# EAGLE design nxt (EAGLE 5.11)
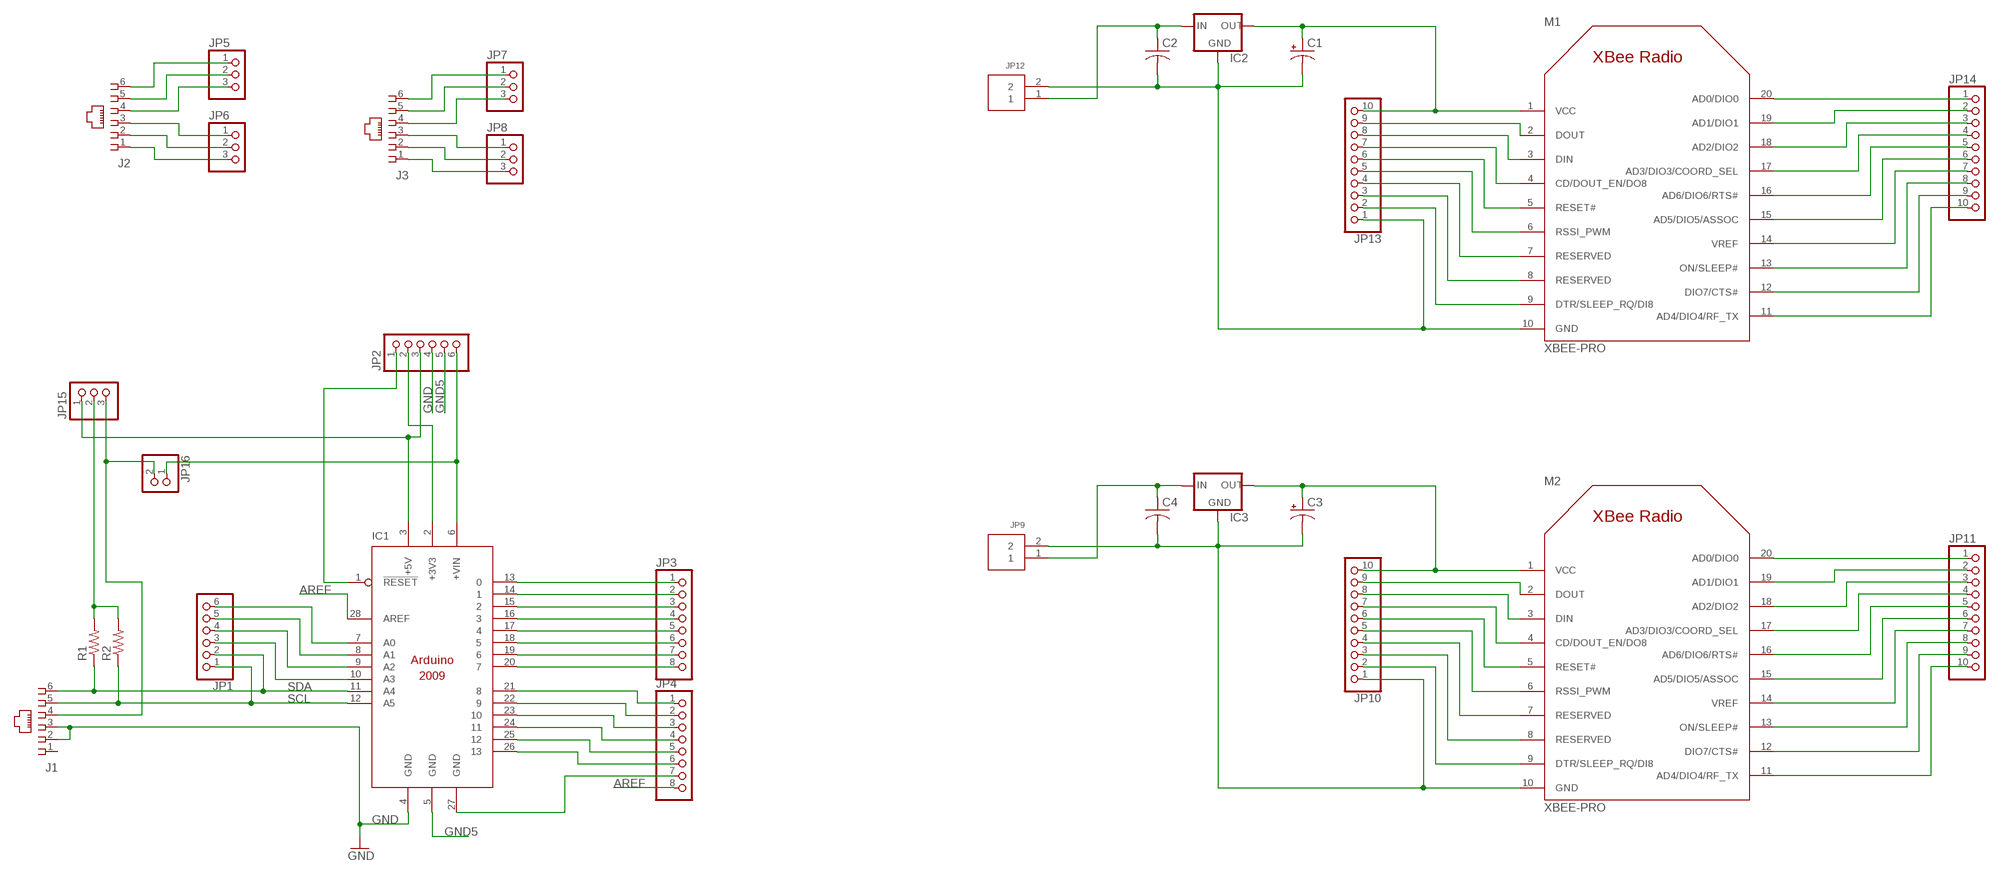
[diagram p0: schematic, sheet 1]

## Parts
C1  CPOL-USE2.5-7  [E2,5-7]
C2  C-US025-040X050  [C025-040X050]
C3  CPOL-USE2.5-7  [E2,5-7]
C4  C-US025-040X050  [C025-040X050]
IC1  ARDUINO2009_11  [ARDUINO2009_1]
IC2  78XXL  [78XXL]
IC3  78XXL  [78XXL]
J1  NXTCONN  [NXTCONN]
J2  NXTCONN  [NXTCONN]
J3  NXTCONN  [NXTCONN]
JP1  PINHD-1X6  [1X06]
JP2  PINHD-1X6  [1X06]
JP3  PINHD-1X8  [1X08]
JP4  PINHD-1X8  [1X08]
JP5  PINHD-1X3  [1X03]
JP6  PINHD-1X3  [1X03]
JP7  PINHD-1X3  [1X03]
JP8  PINHD-1X3  [1X03]
JP9  2PIN  [B2B-PH-K-S]
JP10  PINHD-1X10  [1X10]
JP11  PINHD-1X10  [1X10]
JP12  2PIN  [B2B-PH-K-S]
JP13  PINHD-1X10  [1X10]
JP14  PINHD-1X10  [1X10]
JP15  PINHD-1X3  [1X03]
JP16  PINHD-1X2  [1X02]
M1  XBEE-PRO  [XBEE-PRO]
M2  XBEE-PRO  [XBEE-PRO]
R1  R-US_0207/10  [0207/10]
R2  R-US_0207/10  [0207/10]

## Nets
AREF: IC1.28(AREF) JP4.8
GND: IC1.4(GND) J1.2 J1.3 JP2.4
GND5: IC1.5(GND) JP2.5
N$1: J1.4 JP15.3 JP16.2
N$2: J3.4 JP7.3
N$3: IC1.6(+VIN) JP2.6 JP16.1
N$4: IC1.13 JP3.1
N$5: IC1.14 JP3.2
N$6: IC1.15 JP3.3
N$7: IC1.16 JP3.4
N$8: IC1.17 JP3.5
N$9: IC1.18 JP3.6
N$10: IC1.19 JP3.7
N$11: IC1.20 JP3.8
N$12: IC1.21 JP4.1
N$13: IC1.22 JP4.2
N$14: IC1.23 JP4.3
N$15: IC1.24 JP4.4
N$16: IC1.25 JP4.5
N$17: IC1.26 JP4.6
N$18: IC1.27(GND) JP4.7
N$19: C1.+ IC2.OUT JP13.10 M1.1(VCC)
N$20: JP15.2 R1.2 R2.2
N$21: IC1.2(+3V3) JP2.2
N$22: IC1.10(A3) JP1.3
N$23: IC1.9(A2) JP1.4
N$24: IC1.8(A1) JP1.5
N$25: IC1.7(A0) JP1.6
N$26: IC1.1(!RESET) JP2.1
N$27: IC1.3(+5V) JP2.3 JP15.1
N$28: JP13.9 M1.2(DOUT)
N$29: JP13.8 M1.3(DIN)
N$30: JP13.7 M1.4(CD/DOUT_EN/DO8)
N$31: JP13.6 M1.5(RESET#)
N$32: JP13.5 M1.6(RSSI_PWM)
N$33: JP13.4 M1.7(RESERVED)
N$34: JP13.3 M1.8(RESERVED)
N$35: JP13.2 M1.9(DTR/SLEEP_RQ/DI8)
N$36: JP14.1 M1.20(AD0/DIO0)
N$37: JP14.10 M1.11(AD4/DIO4/RF_TX)
N$38: JP14.9 M1.12(DIO7/CTS#)
N$39: JP14.8 M1.13(ON/SLEEP#)
N$40: JP14.7 M1.14(VREF)
N$41: JP14.6 M1.15(AD5/DIO5/ASSOC)
N$42: JP14.5 M1.16(AD6/DIO6/RTS#)
N$43: JP14.4 M1.17(AD3/DIO3/COORD_SEL)
N$44: JP14.3 M1.18(AD2/DIO2)
N$45: JP14.2 M1.19(AD1/DIO1)
N$46: C2.1 IC2.IN JP12.1
N$47: C1.- C2.2 IC2.GND JP12.2 JP13.1 M1.10(GND)
N$48: J2.4 JP5.3
N$49: J2.5 JP5.2
N$50: J2.6 JP5.1
N$51: J2.3 JP6.1
N$52: J2.2 JP6.2
N$53: J2.1 JP6.3
N$54: J3.5 JP7.2
N$55: J3.6 JP7.1
N$56: J3.3 JP8.1
N$57: J3.2 JP8.2
N$58: J3.1 JP8.3
N$59: C3.+ IC3.OUT JP10.10 M2.1(VCC)
N$60: JP10.9 M2.2(DOUT)
N$61: JP10.8 M2.3(DIN)
N$62: JP10.7 M2.4(CD/DOUT_EN/DO8)
N$63: JP10.6 M2.5(RESET#)
N$64: JP10.5 M2.6(RSSI_PWM)
N$65: JP10.4 M2.7(RESERVED)
N$66: JP10.3 M2.8(RESERVED)
N$67: JP10.2 M2.9(DTR/SLEEP_RQ/DI8)
N$68: JP11.1 M2.20(AD0/DIO0)
N$69: JP11.10 M2.11(AD4/DIO4/RF_TX)
N$70: JP11.9 M2.12(DIO7/CTS#)
N$71: JP11.8 M2.13(ON/SLEEP#)
N$72: JP11.7 M2.14(VREF)
N$73: JP11.6 M2.15(AD5/DIO5/ASSOC)
N$74: JP11.5 M2.16(AD6/DIO6/RTS#)
N$75: JP11.4 M2.17(AD3/DIO3/COORD_SEL)
N$76: JP11.3 M2.18(AD2/DIO2)
N$77: JP11.2 M2.19(AD1/DIO1)
N$78: C4.1 IC3.IN JP9.1
N$79: C3.- C4.2 IC3.GND JP9.2 JP10.1 M2.10(GND)
SCL: IC1.12(A5) J1.5 JP1.1 R2.1
SDA: IC1.11(A4) J1.6 JP1.2 R1.1
Unconnected: J1.1

## Library data of the parts
C1 C3 = rcl:CPOL-US: POLARIZED CAPACITOR, American symbol
C2 C4 = rcl:C-US: CAPACITOR, American symbol
IC1 = arduino:ARDUINO2009_1: The Arduino Duemilanove ("2009") is a microcontroller board based on the ATmega168 or ATmega328. - 14 digital input/output pins (of which 6 can be used as PWM outputs) - 6 analog inputs, a 16 MHz crystal oscillator - USB connection - power jack - ISP header - reset button It contains everything needed to support the microcontroller; simply connect it to a computer with a USB cable or power it with a AC-to-DC adapter or battery to get started http://arduino.cc/en/Main/ArduinoBoardDuemilanove
IC2 IC3 = v-reg:78XXL: VOLTAGE REGULATOR
J1-J3 = eagle-file-for-female-connector:NXTCONN: AMP connector
JP1 JP2 = pinhead:PINHD-1X6: PIN HEADER
JP3 JP4 = pinhead:PINHD-1X8: PIN HEADER
JP5-JP8 JP15 = pinhead:PINHD-1X3: PIN HEADER
JP9 JP12 = jst_eph:2PIN
JP10 JP11 JP13 JP14 = pinhead:PINHD-1X10: PIN HEADER
JP16 = pinhead:PINHD-1X2: PIN HEADER
M1 M2 = xbee_r1:XBEE
R1 R2 = rcl:R-US_: RESISTOR, American symbol

## Net classes
0 default: width 0.813 mm

## Board
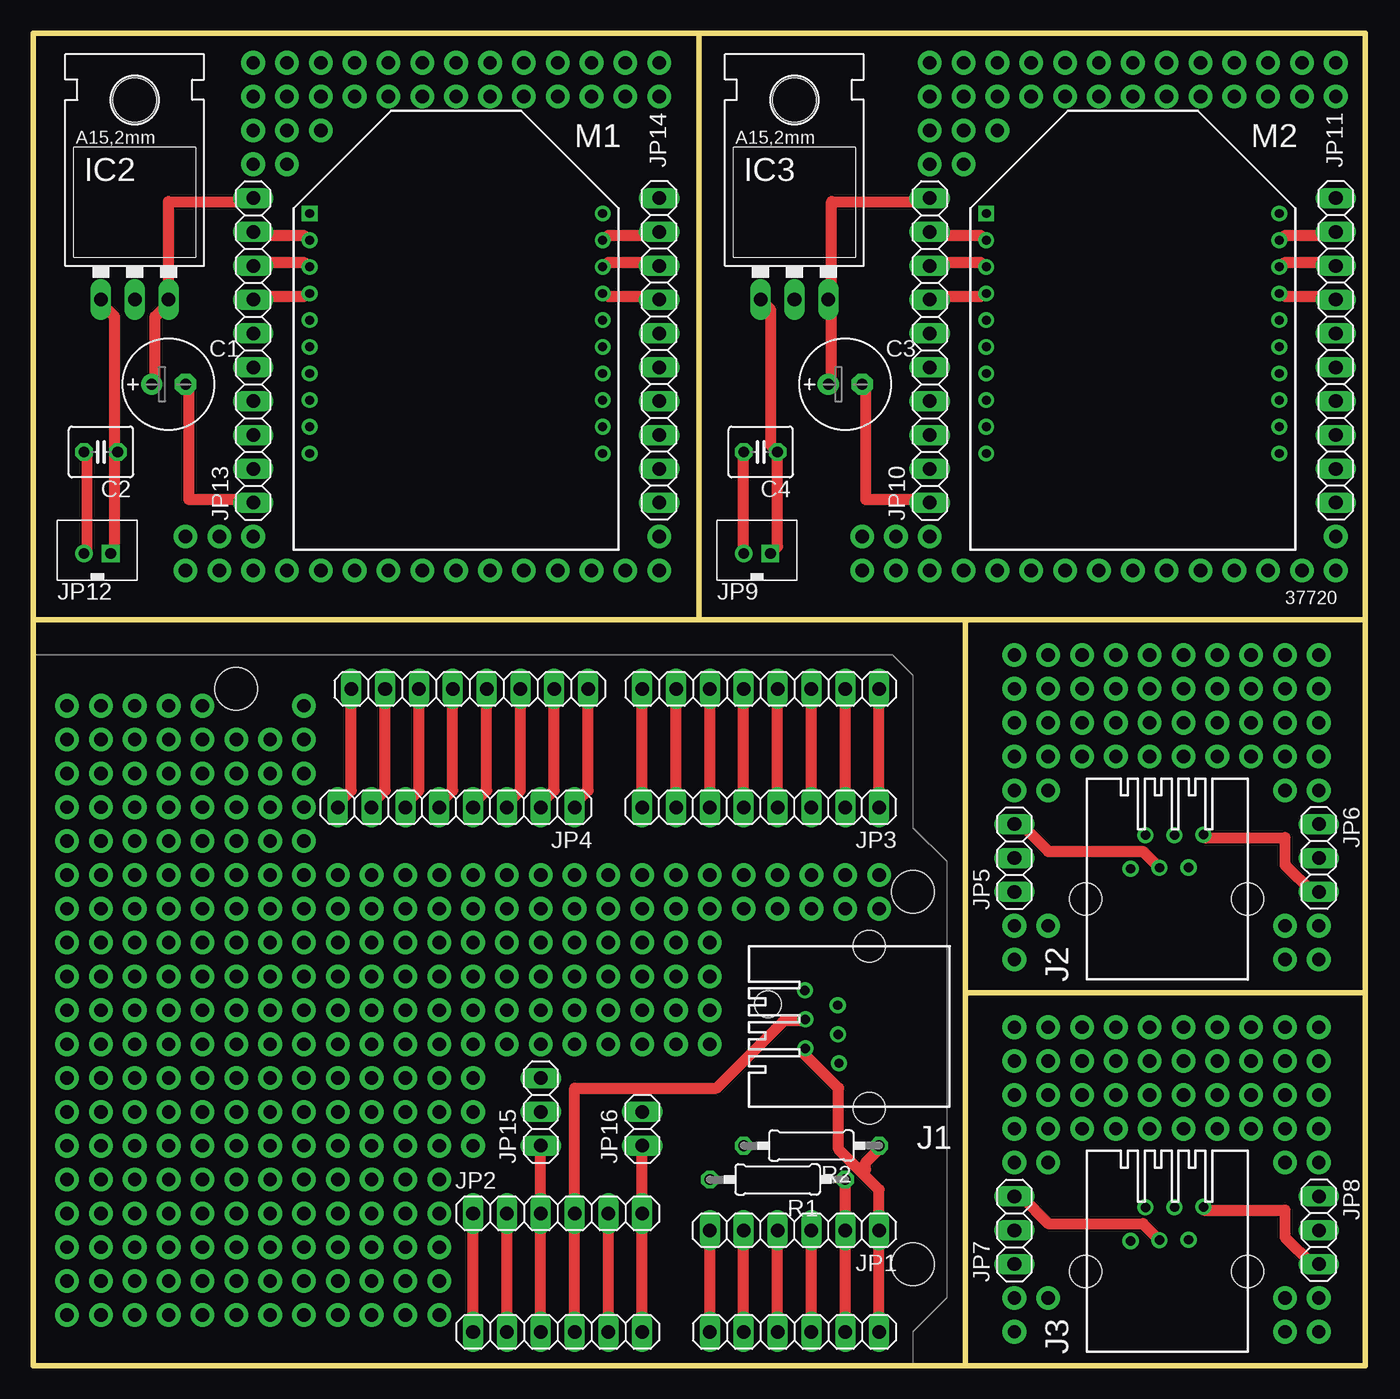
[diagram p1: board, top side]
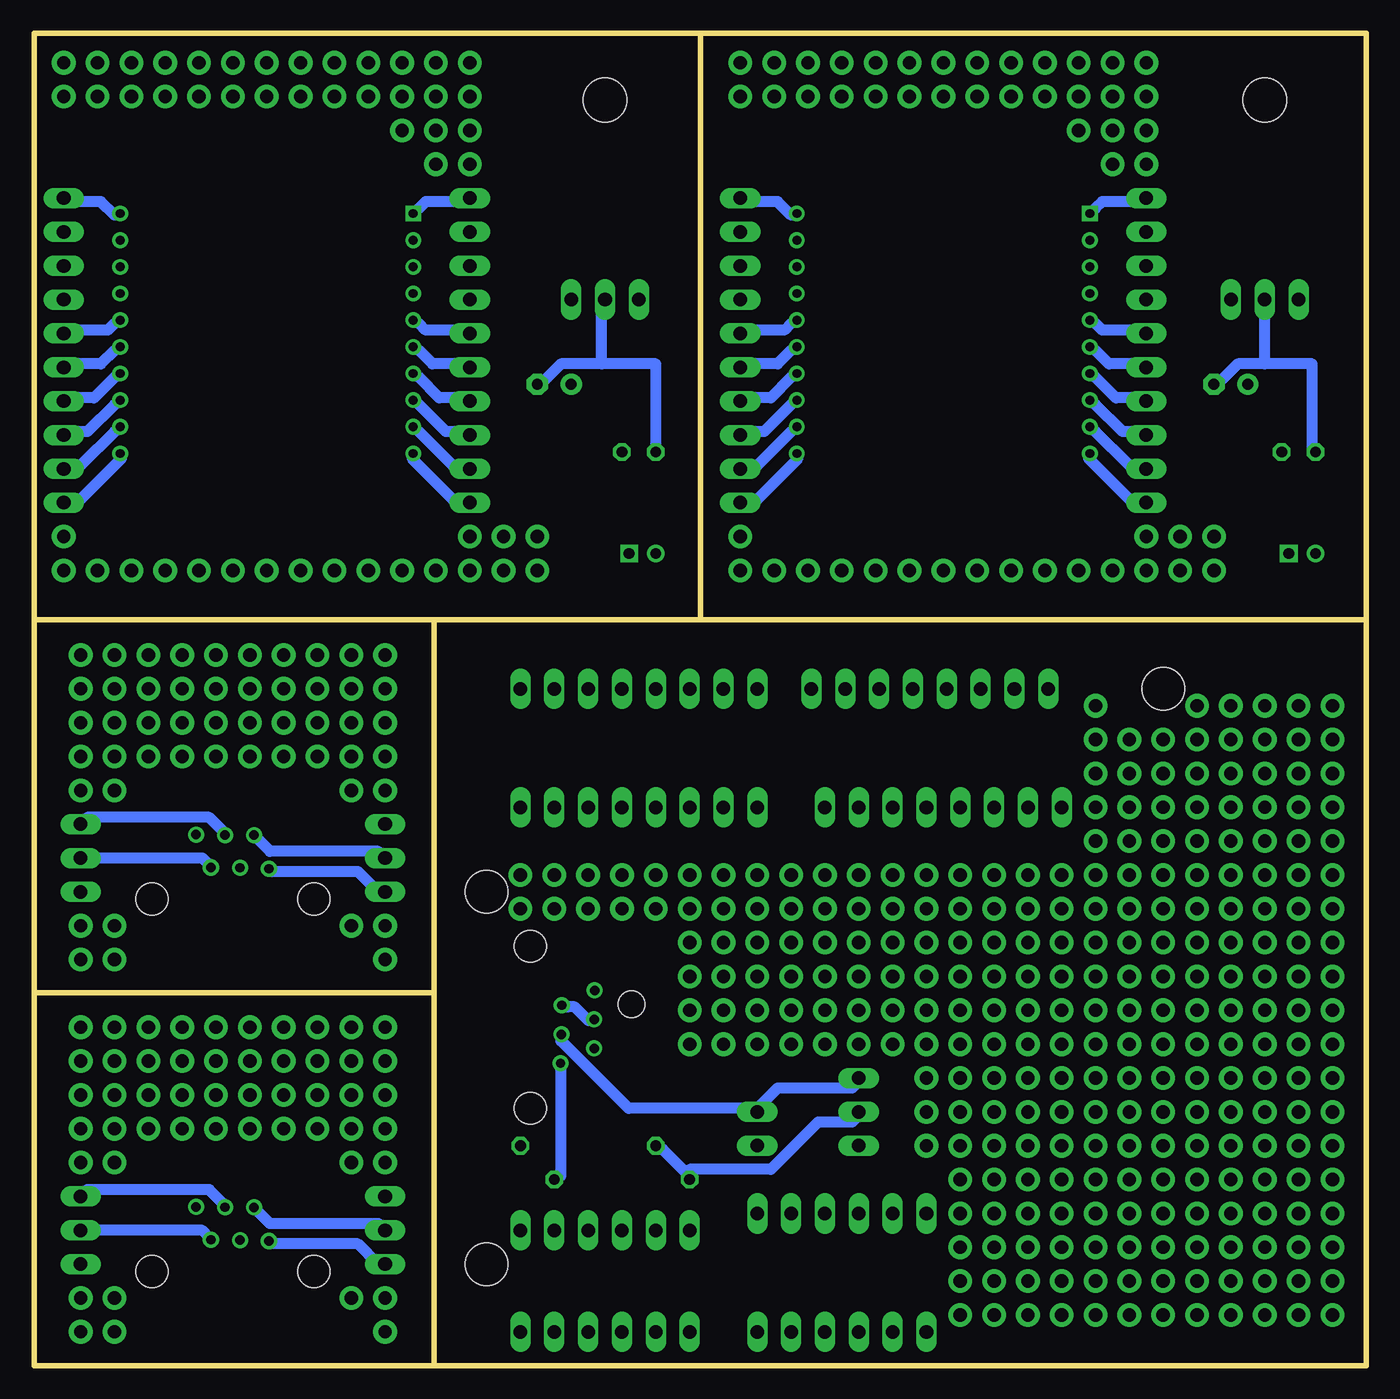
[diagram p2: board, bottom side, seen from below]

Size 100 x 100 mm. Coordinates in mm from the lower left corner, seen from the top.
Outline: 0,56 0,0 70,0
Outline: 0,56 0,100 50,100
Outline: 50,100 100,100 100,56
Outline: 100,56 100,28
Outline: 100,28 100,0 70,0
Outline: 0,56 50,56
Outline: 50,56 70,56
Outline: 70,56 100,56
Outline: 70,56 70,28
Outline: 70,28 70,0
Outline: 70,28 100,28
Outline: 50,56 50,100
Copper layers (1*16): Top 0.035mm / dielectric 1.5mm / Bottom 0.035mm
Design rules "Fusion_eagle_rule_v1.1": minimum track width 6mil, minimum drill 12mil, track to track 6mil, track to pad 6mil, pad to pad 6mil, via to via 6mil, smd to smd 0mil, copper to edge 10mil, drill to drill 10mil, minimum pad ring 10mil, minimum via ring 6mil, stop-mask expansion 2mil, vias tented up to drill 100mil, thermal gap 10mil

### Footprints (pad centres in the part's own frame; a part is rotated, then mirrored left to right if it is on the bottom)
E2,5-7 = drill 0.813 pad 1.6 round: + -1.27,0 | drill 0.813 pad 1.6 octagon: - 1.27,0
C025-040X050 = drill 0.813 octagon: 1 -1.27,0; 2 1.27,0
ARDUINO2009_1 = drill 1.016 long: 1 33.02,2.54; 2 35.56,2.54; 3 38.1,2.54; 4 40.64,2.54; 5 43.18,2.54; 6 45.72,2.54; 7 50.8,2.54; 8 53.34,2.54; 9 55.88,2.54; 10 58.42,2.54; 11 60.96,2.54; 12 63.5,2.54; 13 63.5,50.8; 14 60.96,50.8; 15 58.42,50.8; 16 55.88,50.8; 17 53.34,50.8; 18 50.8,50.8; 19 48.26,50.8; 20 45.72,50.8; 21 41.656,50.8; 22 39.116,50.8; 23 36.576,50.8; 24 34.036,50.8; 25 31.496,50.8; 26 28.956,50.8; 27 26.416,50.8; 28 23.876,50.8 | hole 3.2: 15.24,50.8; 66.04,35.56; 66.04,7.62 | hole 2: 55.17,27.114
78XXL = drill 1.016 long: GND 0,-3.81; IN -2.54,-3.81; OUT 2.54,-3.81 | hole 3.302: 0,11.176
NXTCONN = drill 0.7 round: 1 2.764,6.84; 2 1.647,4.372; 3 0.59,6.805; 4 -0.539,4.346; 5 -1.584,6.804; 6 -2.705,4.28 | hole 2.4: -6.08,2; 6.08,2
1X06 = drill 1.016 long: 1 -6.35,0; 2 -3.81,0; 3 -1.27,0; 4 1.27,0; 5 3.81,0; 6 6.35,0
1X08 = drill 1.016 long: 1 -8.89,0; 2 -6.35,0; 3 -3.81,0; 4 -1.27,0; 5 1.27,0; 6 3.81,0; 7 6.35,0; 8 8.89,0
1X03 = drill 1.016 long: 1 -2.54,0; 2 0,0; 3 2.54,0
B2B-PH-K-S = drill 0.813 square: 1 2,0 | drill 0.813 round: 2 0,0
1X10 = drill 1.016 long: 1 -11.43,0; 2 -8.89,0; 3 -6.35,0; 4 -3.81,0; 5 -1.27,0; 6 1.27,0; 7 3.81,0; 8 6.35,0; 9 8.89,0; 10 11.43,0
1X02 = drill 1.016 long: 1 -1.27,0; 2 1.27,0
XBEE-PRO = drill 0.66 square: 1 -11,9 | drill 0.66 round: 2 -11,7; 3 -11,5; 4 -11,3; 5 -11,1; 6 -11,-1; 7 -11,-3; 8 -11,-5; 9 -11,-7; 10 -11,-9; 11 11,-9; 12 11,-7; 13 11,-5; 14 11,-3; 15 11,-1; 16 11,1; 17 11,3; 18 11,5; 19 11,7; 20 11,9
0207/10 = drill 0.813 octagon: 1 -5.08,0; 2 5.08,0

### Placement (x,y rotation side)
C1  10.16,73.66 0 top
C2  5.08,68.58 180 top
C3  60.96,73.66 0 top
C4  54.61,68.58 180 top
IC1  0,0 0 top
IC2  7.62,83.82 0 top
IC3  57.15,83.82 0 top
J1  64.77,25.4 90 top
J2  85.09,33.02 0 top
J3  85.09,5.08 0 top
JP1  57.15,10.16 180 top
JP2  39.37,11.43 0 top
JP3  54.61,41.91 180 top
JP4  31.75,41.91 180 top
JP5  73.66,38.1 90 top
JP6  96.52,38.1 270 top
JP7  73.66,10.16 90 top
JP8  96.52,10.16 270 top
JP9  53.34,60.96 0 top
JP10  67.31,76.2 90 top
JP11  97.79,76.2 270 top
JP12  3.81,60.96 0 top
JP13  16.51,76.2 90 top
JP14  46.99,76.2 270 top
JP15  38.1,19.05 90 top
JP16  45.72,17.78 90 top
M1  31.75,77.47 0 top
M2  82.55,77.47 0 top
R1  55.88,13.97 180 top
R2  58.42,16.51 180 top

### Tracks (layer width: path | path; a pad name or v marks a point on that pad's centre or on a via)
AREF
  Top 0.813: IC1.28 23.88,43.18 22.86,42.16 JP4.8
GND
  Top 0.813: IC1.4 JP2.4 40.64,20.83 51.31,20.83 56.39,25.91 57.91,25.91 J1.3
  Bottom 0.813: J1.3 58.42,25.91 59.44,26.92 59.94,26.92 J1.2
GND5
  Top 0.813: IC1.5 JP2.5
N$1
  Bottom 0.813: 45.72,19.3 55.37,19.3 60.45,24.38 J1.4 | 45.72,19.3 44.2,20.83 38.61,20.83 38.1,21.34 JP15.3 | 45.72,19.3 JP16.2
N$2
  Top 0.813: JP7.3 74.17,12.7 76.2,10.67 83.31,10.67 84.33,9.65 J3.4
N$3
  Top 0.813: IC1.6 JP2.6 JP16.1
N$4
  Top 0.813: JP3.1 IC1.13
N$5
  Top 0.813: JP3.2 IC1.14
N$6
  Top 0.813: JP3.3 IC1.15
N$7
  Top 0.813: JP3.4 IC1.16
N$8
  Top 0.813: JP3.5 IC1.17
N$9
  Top 0.813: JP3.6 IC1.18
N$10
  Top 0.813: JP3.7 IC1.19
N$11
  Top 0.813: JP3.8 IC1.20
N$12
  Top 0.813: IC1.21 41.66,43.18 40.64,42.16 JP4.1
N$13
  Top 0.813: IC1.22 39.12,43.18 38.1,42.16 JP4.2
N$14
  Top 0.813: IC1.23 36.58,43.18 35.56,42.16 JP4.3
N$15
  Top 0.813: IC1.24 34.04,43.18 33.02,42.16 JP4.4
N$16
  Top 0.813: IC1.25 31.5,43.18 30.48,42.16 JP4.5
N$17
  Top 0.813: IC1.26 28.96,43.18 27.94,42.16 JP4.6
N$18
  Top 0.813: IC1.27 26.42,43.18 25.4,42.16 JP4.7
N$19
  Top 0.813: C1.+ 9.14,73.66 9.14,78.74 10.16,79.76 IC2.OUT 10.16,87.38 16.26,87.38 JP13.10
  Bottom 0.813: M1.1 20.32,86.87 19.81,87.38 16.76,87.38 JP13.10
N$20
  Bottom 0.813: 51.05,14.48 52.83,16.26 53.34,16.26 R2.2 | 51.05,14.48 50.8,14.22 R1.2 | JP15.2 38.1,18.8 38.61,18.29 41.15,18.29 44.7,14.73 50.8,14.73 51.05,14.48
N$21
  Top 0.813: IC1.2 JP2.2
N$22
  Top 0.813: IC1.10 JP1.3
N$23
  Top 0.813: IC1.9 JP1.4
N$24
  Top 0.813: IC1.8 JP1.5
N$25
  Top 0.813: IC1.7 JP1.6
N$26
  Top 0.813: IC1.1 JP2.1
N$27
  Top 0.813: IC1.3 JP2.3 JP15.1
N$28
  Top 0.813: M1.2 20.32,84.84 16.76,84.84 JP13.9
N$29
  Top 0.813: M1.3 20.32,82.8 16.76,82.8 JP13.8
N$30
  Top 0.813: M1.4 20.32,80.26 16.76,80.26 JP13.7
N$31
  Bottom 0.813: M1.5 20.32,78.23 19.81,77.72 16.76,77.72 JP13.6
N$32
  Bottom 0.813: M1.6 20.32,76.2 19.3,75.18 16.76,75.18 JP13.5
N$33
  Bottom 0.813: M1.7 20.32,74.17 18.8,72.64 16.76,72.64 JP13.4
N$34
  Bottom 0.813: M1.8 20.32,72.14 18.29,70.1 16.76,70.1 JP13.3
N$35
  Bottom 0.813: M1.9 20.32,70.1 17.78,67.56 16.76,67.56 JP13.2
N$36
  Bottom 0.813: M1.20 43.18,86.36 44.2,87.38 46.74,87.38 JP14.1
N$37
  Bottom 0.813: M1.11 42.67,68.07 45.72,65.02 46.74,65.02 JP14.10
N$38
  Bottom 0.813: M1.12 43.18,70.1 45.72,67.56 46.74,67.56 JP14.9
N$39
  Bottom 0.813: M1.13 43.18,72.14 45.21,70.1 46.74,70.1 JP14.8
N$40
  Bottom 0.813: M1.14 43.18,74.17 44.7,72.64 46.74,72.64 JP14.7
N$41
  Bottom 0.813: M1.15 43.18,76.2 44.2,75.18 46.74,75.18 JP14.6
N$42
  Bottom 0.813: M1.16 43.18,78.23 43.69,77.72 46.74,77.72 JP14.5
N$43
  Top 0.813: M1.17 43.18,80.26 46.74,80.26 JP14.4
N$44
  Top 0.813: M1.18 43.18,82.8 46.74,82.8 JP14.3
N$45
  Top 0.813: M1.19 43.18,84.84 46.74,84.84 JP14.2
N$46
  Top 0.813: 6.1,68.58 6.1,60.96 JP12.1 | 6.1,68.58 6.1,78.74 5.08,79.76 IC2.IN | 6.1,68.58 C2.1
N$47
  Top 0.813: JP12.2 4.06,60.96 4.06,68.58 C2.2 | JP13.1 16.26,65.02 11.68,65.02 11.68,73.66 C1.-
  Bottom 0.813: M1.10 20.83,68.07 17.78,65.02 16.76,65.02 JP13.1 | 7.62,75.18 9.65,75.18 11.18,73.66 C1.- | 7.62,75.18 IC2.GND | 7.62,75.18 4.06,75.18 4.06,68.58 C2.2
N$48
  Top 0.813: JP5.3 74.17,40.64 76.2,38.61 83.31,38.61 84.33,37.59 J2.4
N$49
  Bottom 0.813: JP5.2 74.17,38.61 82.3,38.61 83.31,39.62 J2.5
N$50
  Bottom 0.813: JP5.1 74.17,35.56 75.69,37.08 82.3,37.08 J2.6
N$51
  Bottom 0.813: JP6.1 96.01,41.15 86.87,41.15 85.85,40.13 J2.3
N$52
  Bottom 0.813: JP6.2 87.38,38.1 86.87,37.59 J2.2
N$53
  Top 0.813: JP6.3 96.01,35.56 93.98,37.59 93.98,39.62 87.88,39.62 J2.1
N$54
  Bottom 0.813: JP7.2 74.17,10.67 82.3,10.67 83.31,11.68 J3.5
N$55
  Bottom 0.813: JP7.1 74.17,7.62 75.69,9.14 82.3,9.14 J3.6
N$56
  Bottom 0.813: JP8.1 96.01,13.21 86.87,13.21 85.85,12.19 J3.3
N$57
  Bottom 0.813: JP8.2 87.38,10.16 86.87,9.65 J3.2
N$58
  Top 0.813: JP8.3 96.01,7.62 93.98,9.65 93.98,11.68 87.88,11.68 J3.1
N$59
  Top 0.813: C3.+ 59.94,73.66 59.94,79.76 IC3.OUT 59.94,80.26 59.94,87.38 67.06,87.38 JP10.10
  Bottom 0.813: M2.1 71.12,86.87 70.61,87.38 67.56,87.38 JP10.10
N$60
  Top 0.813: M2.2 71.12,84.84 67.56,84.84 JP10.9
N$61
  Top 0.813: M2.3 71.12,82.8 67.56,82.8 JP10.8
N$62
  Top 0.813: M2.4 71.12,80.26 67.56,80.26 JP10.7
N$63
  Bottom 0.813: M2.5 71.12,78.23 70.61,77.72 67.56,77.72 JP10.6
N$64
  Bottom 0.813: M2.6 71.12,76.2 70.1,75.18 67.56,75.18 JP10.5
N$65
  Bottom 0.813: M2.7 71.12,74.17 69.6,72.64 67.56,72.64 JP10.4
N$66
  Bottom 0.813: M2.8 71.12,72.14 69.09,70.1 67.56,70.1 JP10.3
N$67
  Bottom 0.813: M2.9 71.12,70.1 68.58,67.56 67.56,67.56 JP10.2
N$68
  Bottom 0.813: M2.20 93.98,86.36 95,87.38 97.54,87.38 JP11.1
N$69
  Bottom 0.813: M2.11 93.47,68.07 96.52,65.02 97.54,65.02 JP11.10
N$70
  Bottom 0.813: M2.12 93.98,70.1 96.52,67.56 97.54,67.56 JP11.9
N$71
  Bottom 0.813: M2.13 93.98,72.14 96.01,70.1 97.54,70.1 JP11.8
N$72
  Bottom 0.813: M2.14 93.98,74.17 95.5,72.64 97.54,72.64 JP11.7
N$73
  Bottom 0.813: M2.15 93.98,76.2 95,75.18 97.54,75.18 JP11.6
N$74
  Bottom 0.813: M2.16 93.98,78.23 94.49,77.72 97.54,77.72 JP11.5
N$75
  Top 0.813: M2.17 93.98,80.26 97.54,80.26 JP11.4
N$76
  Top 0.813: M2.18 93.98,82.8 97.54,82.8 JP11.3
N$77
  Top 0.813: M2.19 93.98,84.84 97.54,84.84 JP11.2
N$78
  Top 0.813: JP9.1 55.37,60.96 55.88,61.47 C4.1 55.37,69.09 55.37,79.25 IC3.IN
N$79
  Top 0.813: JP9.2 C4.2 | JP10.1 67.06,65.02 62.48,65.02 62.48,73.66 C3.-
  Bottom 0.813: M2.10 71.63,68.07 68.58,65.02 67.56,65.02 JP10.1 | 57.4,75.18 57.4,79.76 IC3.GND | 57.4,75.18 60.45,75.18 61.98,73.66 C3.- | C4.2 53.34,75.18 57.4,75.18
S$1  (via drill 1 pad 1.78)
  other vias: 73.66,15.24
S$2  (via drill 1 pad 1.78)
  other vias: 73.66,17.78
S$3  (via drill 1 pad 1.78)
  other vias: 73.66,20.32
S$4  (via drill 1 pad 1.78)
  other vias: 73.66,22.86
S$5  (via drill 1 pad 1.78)
  other vias: 73.66,25.4
S$6  (via drill 1 pad 1.78)
  other vias: 76.2,25.4
S$7  (via drill 1 pad 1.78)
  other vias: 76.2,22.86
S$8  (via drill 1 pad 1.78)
  other vias: 76.2,20.32
S$9  (via drill 1 pad 1.78)
  other vias: 76.2,17.78
S$10  (via drill 1 pad 1.78)
  other vias: 76.2,15.24
S$11  (via drill 1 pad 1.78)
  other vias: 78.74,17.78
S$12  (via drill 1 pad 1.78)
  other vias: 78.74,20.32
S$13  (via drill 1 pad 1.78)
  other vias: 78.74,22.86
S$14  (via drill 1 pad 1.78)
  other vias: 78.74,25.4
S$15  (via drill 1 pad 1.78)
  other vias: 81.28,25.4
S$16  (via drill 1 pad 1.78)
  other vias: 81.28,22.86
S$17  (via drill 1 pad 1.78)
  other vias: 81.28,20.32
S$18  (via drill 1 pad 1.78)
  other vias: 81.28,17.78
S$19  (via drill 1 pad 1.78)
  other vias: 83.82,17.78
S$20  (via drill 1 pad 1.78)
  other vias: 83.82,20.32
S$21  (via drill 1 pad 1.78)
  other vias: 83.82,22.86
S$22  (via drill 1 pad 1.78)
  other vias: 83.82,25.4
S$23  (via drill 1 pad 1.78)
  other vias: 86.36,25.4
S$24  (via drill 1 pad 1.78)
  other vias: 86.36,22.86
S$25  (via drill 1 pad 1.78)
  other vias: 86.36,20.32
S$26  (via drill 1 pad 1.78)
  other vias: 86.36,17.78
S$27  (via drill 1 pad 1.78)
  other vias: 88.9,17.78
S$28  (via drill 1 pad 1.78)
  other vias: 88.9,20.32
S$29  (via drill 1 pad 1.78)
  other vias: 88.9,22.86
S$30  (via drill 1 pad 1.78)
  other vias: 88.9,25.4
S$31  (via drill 1 pad 1.78)
  other vias: 91.44,25.4
S$32  (via drill 1 pad 1.78)
  other vias: 91.44,22.86
S$33  (via drill 1 pad 1.78)
  other vias: 91.44,20.32
S$34  (via drill 1 pad 1.78)
  other vias: 91.44,17.78
S$35  (via drill 1 pad 1.78)
  other vias: 93.98,17.78
S$36  (via drill 1 pad 1.78)
  other vias: 96.52,17.78
S$37  (via drill 1 pad 1.78)
  other vias: 96.52,20.32
S$38  (via drill 1 pad 1.78)
  other vias: 93.98,20.32
S$39  (via drill 1 pad 1.78)
  other vias: 93.98,22.86
S$40  (via drill 1 pad 1.78)
  other vias: 93.98,25.4
S$41  (via drill 1 pad 1.78)
  other vias: 96.52,25.4
S$42  (via drill 1 pad 1.78)
  other vias: 96.52,22.86
S$43  (via drill 1 pad 1.78)
  other vias: 73.66,5.08
S$44  (via drill 1 pad 1.78)
  other vias: 73.66,2.54
S$45  (via drill 1 pad 1.78)
  other vias: 96.52,5.08
S$46  (via drill 1 pad 1.78)
  other vias: 96.52,2.54
S$47  (via drill 1 pad 1.78)
  other vias: 93.98,5.08
S$48  (via drill 1 pad 1.78)
  other vias: 93.98,2.54
S$49  (via drill 1 pad 1.78)
  other vias: 76.2,5.08
S$50  (via drill 1 pad 1.78)
  other vias: 73.66,33.02
S$51  (via drill 1 pad 1.78)
  other vias: 73.66,30.48
S$52  (via drill 1 pad 1.78)
  other vias: 76.2,33.02
S$53  (via drill 1 pad 1.78)
  other vias: 96.52,33.02
S$54  (via drill 1 pad 1.78)
  other vias: 96.52,30.48
S$55  (via drill 1 pad 1.78)
  other vias: 93.98,33.02
S$56  (via drill 1 pad 1.78)
  other vias: 93.98,30.48
S$57  (via drill 1 pad 1.78)
  other vias: 73.66,43.18
S$58  (via drill 1 pad 1.78)
  other vias: 76.2,43.18
S$59  (via drill 1 pad 1.78)
  other vias: 73.66,45.72
S$60  (via drill 1 pad 1.78)
  other vias: 76.2,45.72
S$61  (via drill 1 pad 1.78)
  other vias: 73.66,48.26
S$62  (via drill 1 pad 1.78)
  other vias: 73.66,50.8
S$63  (via drill 1 pad 1.78)
  other vias: 73.66,53.34
S$64  (via drill 1 pad 1.78)
  other vias: 76.2,53.34
S$65  (via drill 1 pad 1.78)
  other vias: 76.2,50.8
S$66  (via drill 1 pad 1.78)
  other vias: 76.2,48.26
S$67  (via drill 1 pad 1.78)
  other vias: 78.74,53.34
S$68  (via drill 1 pad 1.78)
  other vias: 81.28,53.34
S$69  (via drill 1 pad 1.78)
  other vias: 83.82,53.34
S$70  (via drill 1 pad 1.78)
  other vias: 86.36,53.34
S$71  (via drill 1 pad 1.78)
  other vias: 88.9,53.34
S$72  (via drill 1 pad 1.78)
  other vias: 91.44,53.34
S$73  (via drill 1 pad 1.78)
  other vias: 93.98,53.34
S$74  (via drill 1 pad 1.78)
  other vias: 96.52,53.34
S$75  (via drill 1 pad 1.78)
  other vias: 96.52,50.8
S$76  (via drill 1 pad 1.78)
  other vias: 93.98,50.8
S$77  (via drill 1 pad 1.78)
  other vias: 91.44,50.8
S$78  (via drill 1 pad 1.78)
  other vias: 88.9,50.8
S$79  (via drill 1 pad 1.78)
  other vias: 86.36,50.8
S$80  (via drill 1 pad 1.78)
  other vias: 83.82,50.8
S$81  (via drill 1 pad 1.78)
  other vias: 81.28,50.8
S$82  (via drill 1 pad 1.78)
  other vias: 78.74,50.8
S$83  (via drill 1 pad 1.78)
  other vias: 78.74,48.26
S$84  (via drill 1 pad 1.78)
  other vias: 78.74,45.72
S$85  (via drill 1 pad 1.78)
  other vias: 81.28,48.26
S$86  (via drill 1 pad 1.78)
  other vias: 81.28,45.72
S$87  (via drill 1 pad 1.78)
  other vias: 83.82,45.72
S$88  (via drill 1 pad 1.78)
  other vias: 83.82,48.26
S$89  (via drill 1 pad 1.78)
  other vias: 86.36,48.26
S$90  (via drill 1 pad 1.78)
  other vias: 86.36,45.72
S$91  (via drill 1 pad 1.78)
  other vias: 88.9,45.72
S$92  (via drill 1 pad 1.78)
  other vias: 88.9,48.26
S$93  (via drill 1 pad 1.78)
  other vias: 91.44,48.26
S$94  (via drill 1 pad 1.78)
  other vias: 91.44,45.72
S$95  (via drill 1 pad 1.78)
  other vias: 93.98,45.72
S$96  (via drill 1 pad 1.78)
  other vias: 93.98,48.26
S$97  (via drill 1 pad 1.78)
  other vias: 96.52,48.26
S$98  (via drill 1 pad 1.78)
  other vias: 96.52,45.72
S$99  (via drill 1 pad 1.78)
  other vias: 96.52,43.18
S$100  (via drill 1 pad 1.78)
  other vias: 93.98,43.18
S$101  (via drill 1 pad 1.78)
  other vias: 96.52,15.24
S$102  (via drill 1 pad 1.78)
  other vias: 93.98,15.24
S$103  (via drill 1 pad 1.78)
  other vias: 16.51,90.17
S$104  (via drill 1 pad 1.78)
  other vias: 16.51,92.71
S$105  (via drill 1 pad 1.78)
  other vias: 16.51,95.25
S$106  (via drill 1 pad 1.78)
  other vias: 16.51,97.79
S$107  (via drill 1 pad 1.78)
  other vias: 19.05,97.79
S$108  (via drill 1 pad 1.78)
  other vias: 19.05,95.25
S$109  (via drill 1 pad 1.78)
  other vias: 19.05,92.71
S$110  (via drill 1 pad 1.78)
  other vias: 19.05,90.17
S$111  (via drill 1 pad 1.78)
  other vias: 21.59,97.79
S$112  (via drill 1 pad 1.78)
  other vias: 24.13,97.79
S$113  (via drill 1 pad 1.78)
  other vias: 26.67,97.79
S$114  (via drill 1 pad 1.78)
  other vias: 29.21,97.79
S$115  (via drill 1 pad 1.78)
  other vias: 31.75,97.79
S$116  (via drill 1 pad 1.78)
  other vias: 34.29,97.79
S$117  (via drill 1 pad 1.78)
  other vias: 36.83,97.79
S$118  (via drill 1 pad 1.78)
  other vias: 39.37,97.79
S$119  (via drill 1 pad 1.78)
  other vias: 41.91,97.79
S$120  (via drill 1 pad 1.78)
  other vias: 44.45,97.79
S$121  (via drill 1 pad 1.78)
  other vias: 46.99,97.79
S$122  (via drill 1 pad 1.78)
  other vias: 46.99,95.25
S$123  (via drill 1 pad 1.78)
  other vias: 44.45,95.25
S$124  (via drill 1 pad 1.78)
  other vias: 41.91,95.25
S$125  (via drill 1 pad 1.78)
  other vias: 39.37,95.25
S$126  (via drill 1 pad 1.78)
  other vias: 36.83,95.25
S$127  (via drill 1 pad 1.78)
  other vias: 34.29,95.25
S$128  (via drill 1 pad 1.78)
  other vias: 31.75,95.25
S$129  (via drill 1 pad 1.78)
  other vias: 29.21,95.25
S$130  (via drill 1 pad 1.78)
  other vias: 26.67,95.25
S$131  (via drill 1 pad 1.78)
  other vias: 24.13,95.25
S$132  (via drill 1 pad 1.78)
  other vias: 21.59,95.25
S$133  (via drill 1 pad 1.78)
  other vias: 21.59,92.71
S$134  (via drill 1 pad 1.78)
  other vias: 33.02,16.51
S$135  (via drill 1 pad 1.78)
  other vias: 33.02,19.05
S$136  (via drill 1 pad 1.78)
  other vias: 33.02,21.59
S$137  (via drill 1 pad 1.78)
  other vias: 33.02,24.13
S$138  (via drill 1 pad 1.78)
  other vias: 16.51,62.23
S$139  (via drill 1 pad 1.78)
  other vias: 13.97,62.23
S$140  (via drill 1 pad 1.78)
  other vias: 11.43,62.23
S$141  (via drill 1 pad 1.78)
  other vias: 11.43,59.69
S$142  (via drill 1 pad 1.78)
  other vias: 13.97,59.69
S$143  (via drill 1 pad 1.78)
  other vias: 16.51,59.69
S$144  (via drill 1 pad 1.78)
  other vias: 19.05,59.69
S$145  (via drill 1 pad 1.78)
  other vias: 21.59,59.69
S$146  (via drill 1 pad 1.78)
  other vias: 24.13,59.69
S$147  (via drill 1 pad 1.78)
  other vias: 26.67,59.69
S$148  (via drill 1 pad 1.78)
  other vias: 29.21,59.69
S$149  (via drill 1 pad 1.78)
  other vias: 31.75,59.69
S$150  (via drill 1 pad 1.78)
  other vias: 34.29,59.69
S$151  (via drill 1 pad 1.78)
  other vias: 36.83,59.69
S$152  (via drill 1 pad 1.78)
  other vias: 39.37,59.69
S$153  (via drill 1 pad 1.78)
  other vias: 41.91,59.69
S$154  (via drill 1 pad 1.78)
  other vias: 44.45,59.69
S$155  (via drill 1 pad 1.78)
  other vias: 46.99,59.69
S$156  (via drill 1 pad 1.78)
  other vias: 46.99,62.23
S$157  (via drill 1 pad 1.78)
  other vias: 67.31,90.17
S$158  (via drill 1 pad 1.78)
  other vias: 67.31,92.71
S$159  (via drill 1 pad 1.78)
  other vias: 67.31,95.25
S$160  (via drill 1 pad 1.78)
  other vias: 67.31,97.79
S$161  (via drill 1 pad 1.78)
  other vias: 69.85,97.79
S$162  (via drill 1 pad 1.78)
  other vias: 69.85,95.25
S$163  (via drill 1 pad 1.78)
  other vias: 69.85,92.71
S$164  (via drill 1 pad 1.78)
  other vias: 69.85,90.17
S$165  (via drill 1 pad 1.78)
  other vias: 72.39,92.71
S$166  (via drill 1 pad 1.78)
  other vias: 72.39,95.25
S$167  (via drill 1 pad 1.78)
  other vias: 72.39,97.79
S$168  (via drill 1 pad 1.78)
  other vias: 74.93,97.79
S$169  (via drill 1 pad 1.78)
  other vias: 74.93,95.25
S$170  (via drill 1 pad 1.78)
  other vias: 77.47,97.79
S$171  (via drill 1 pad 1.78)
  other vias: 77.47,95.25
S$172  (via drill 1 pad 1.78)
  other vias: 80.01,97.79
S$173  (via drill 1 pad 1.78)
  other vias: 80.01,95.25
S$174  (via drill 1 pad 1.78)
  other vias: 82.55,95.25
S$175  (via drill 1 pad 1.78)
  other vias: 82.55,97.79
S$176  (via drill 1 pad 1.78)
  other vias: 85.09,97.79
S$177  (via drill 1 pad 1.78)
  other vias: 85.09,95.25
S$178  (via drill 1 pad 1.78)
  other vias: 87.63,95.25
S$179  (via drill 1 pad 1.78)
  other vias: 87.63,97.79
S$180  (via drill 1 pad 1.78)
  other vias: 90.17,97.79
S$181  (via drill 1 pad 1.78)
  other vias: 90.17,95.25
S$182  (via drill 1 pad 1.78)
  other vias: 92.71,95.25
S$183  (via drill 1 pad 1.78)
  other vias: 92.71,97.79
S$184  (via drill 1 pad 1.78)
  other vias: 95.25,97.79
S$185  (via drill 1 pad 1.78)
  other vias: 95.25,95.25
S$186  (via drill 1 pad 1.78)
  other vias: 97.79,95.25
S$187  (via drill 1 pad 1.78)
  other vias: 97.79,97.79
S$188  (via drill 1 pad 1.78)
  other vias: 33.02,26.67
S$189  (via drill 1 pad 1.78)
  other vias: 33.02,29.21
S$190  (via drill 1 pad 1.78)
  other vias: 33.02,31.75
S$191  (via drill 1 pad 1.78)
  other vias: 33.02,34.29
S$192  (via drill 1 pad 1.78)
  other vias: 67.31,62.23
S$193  (via drill 1 pad 1.78)
  other vias: 64.77,62.23
S$194  (via drill 1 pad 1.78)
  other vias: 62.23,62.23
S$195  (via drill 1 pad 1.78)
  other vias: 62.23,59.69
S$196  (via drill 1 pad 1.78)
  other vias: 64.77,59.69
S$197  (via drill 1 pad 1.78)
  other vias: 67.31,59.69
S$198  (via drill 1 pad 1.78)
  other vias: 69.85,59.69
S$199  (via drill 1 pad 1.78)
  other vias: 72.39,59.69
S$200  (via drill 1 pad 1.78)
  other vias: 74.93,59.69
S$201  (via drill 1 pad 1.78)
  other vias: 77.47,59.69
S$202  (via drill 1 pad 1.78)
  other vias: 80.01,59.69
S$203  (via drill 1 pad 1.78)
  other vias: 82.55,59.69
S$204  (via drill 1 pad 1.78)
  other vias: 85.09,59.69
S$205  (via drill 1 pad 1.78)
  other vias: 87.63,59.69
S$206  (via drill 1 pad 1.78)
  other vias: 90.17,59.69
S$207  (via drill 1 pad 1.78)
  other vias: 92.71,59.69
S$208  (via drill 1 pad 1.78)
  other vias: 95.25,59.69
S$209  (via drill 1 pad 1.78)
  other vias: 97.79,59.69
S$210  (via drill 1 pad 1.78)
  other vias: 97.79,62.23
S$211  (via drill 1 pad 1.78)
  other vias: 33.02,36.83
S$212  (via drill 1 pad 1.78)
  other vias: 35.56,24.13
S$213  (via drill 1 pad 1.78)
  other vias: 35.56,26.67
S$214  (via drill 1 pad 1.78)
  other vias: 35.56,29.21
S$215  (via drill 1 pad 1.78)
  other vias: 35.56,31.75
S$216  (via drill 1 pad 1.78)
  other vias: 35.56,34.29
S$217  (via drill 1 pad 1.78)
  other vias: 35.56,36.83
S$218  (via drill 1 pad 1.78)
  other vias: 38.1,36.83
S$219  (via drill 1 pad 1.78)
  other vias: 38.1,34.29
S$220  (via drill 1 pad 1.78)
  other vias: 38.1,31.75
S$221  (via drill 1 pad 1.78)
  other vias: 38.1,29.21
S$222  (via drill 1 pad 1.78)
  other vias: 38.1,26.67
S$223  (via drill 1 pad 1.78)
  other vias: 38.1,24.13
S$224  (via drill 1 pad 1.78)
  other vias: 40.64,24.13
S$225  (via drill 1 pad 1.78)
  other vias: 40.64,26.67
S$226  (via drill 1 pad 1.78)
  other vias: 40.64,29.21
S$227  (via drill 1 pad 1.78)
  other vias: 40.64,31.75
S$228  (via drill 1 pad 1.78)
  other vias: 40.64,34.29
S$229  (via drill 1 pad 1.78)
  other vias: 40.64,36.83
S$230  (via drill 1 pad 1.78)
  other vias: 43.18,36.83
S$231  (via drill 1 pad 1.78)
  other vias: 45.72,36.83
S$232  (via drill 1 pad 1.78)
  other vias: 43.18,34.29
S$233  (via drill 1 pad 1.78)
  other vias: 43.18,31.75
S$234  (via drill 1 pad 1.78)
  other vias: 43.18,29.21
S$235  (via drill 1 pad 1.78)
  other vias: 43.18,26.67
S$236  (via drill 1 pad 1.78)
  other vias: 43.18,24.13
S$237  (via drill 1 pad 1.78)
  other vias: 45.72,24.13
S$238  (via drill 1 pad 1.78)
  other vias: 45.72,26.67
S$239  (via drill 1 pad 1.78)
  other vias: 45.72,29.21
S$240  (via drill 1 pad 1.78)
  other vias: 45.72,31.75
S$241  (via drill 1 pad 1.78)
  other vias: 45.72,34.29
S$242  (via drill 1 pad 1.78)
  other vias: 48.26,36.83
S$243  (via drill 1 pad 1.78)
  other vias: 48.26,34.29
S$244  (via drill 1 pad 1.78)
  other vias: 48.26,31.75
S$245  (via drill 1 pad 1.78)
  other vias: 48.26,29.21
S$246  (via drill 1 pad 1.78)
  other vias: 48.26,26.67
S$247  (via drill 1 pad 1.78)
  other vias: 48.26,24.13
S$248  (via drill 1 pad 1.78)
  other vias: 50.8,24.13
S$249  (via drill 1 pad 1.78)
  other vias: 50.8,26.67
S$250  (via drill 1 pad 1.78)
  other vias: 50.8,29.21
S$251  (via drill 1 pad 1.78)
  other vias: 50.8,31.75
S$252  (via drill 1 pad 1.78)
  other vias: 50.8,34.29
S$253  (via drill 1 pad 1.78)
  other vias: 50.8,36.83
S$254  (via drill 1 pad 1.78)
  other vias: 53.34,36.83
S$255  (via drill 1 pad 1.78)
  other vias: 53.34,34.29
S$256  (via drill 1 pad 1.78)
  other vias: 55.88,34.29
S$257  (via drill 1 pad 1.78)
  other vias: 55.88,36.83
S$258  (via drill 1 pad 1.78)
  other vias: 58.42,36.83
S$259  (via drill 1 pad 1.78)
  other vias: 58.42,34.29
S$260  (via drill 1 pad 1.78)
  other vias: 60.96,36.83
S$261  (via drill 1 pad 1.78)
  other vias: 60.96,34.29
S$262  (via drill 1 pad 1.78)
  other vias: 63.5,36.83
S$263  (via drill 1 pad 1.78)
  other vias: 63.5,34.29
S$264  (via drill 1 pad 1.78)
  other vias: 30.48,36.83
S$265  (via drill 1 pad 1.78)
  other vias: 27.94,36.83
S$266  (via drill 1 pad 1.78)
  other vias: 25.4,36.83
S$267  (via drill 1 pad 1.78)
  other vias: 22.86,36.83
S$268  (via drill 1 pad 1.78)
  other vias: 22.86,34.29
S$269  (via drill 1 pad 1.78)
  other vias: 25.4,34.29
S$270  (via drill 1 pad 1.78)
  other vias: 27.94,34.29
S$271  (via drill 1 pad 1.78)
  other vias: 30.48,34.29
S$272  (via drill 1 pad 1.78)
  other vias: 30.48,31.75
S$273  (via drill 1 pad 1.78)
  other vias: 27.94,31.75
S$274  (via drill 1 pad 1.78)
  other vias: 25.4,31.75
S$275  (via drill 1 pad 1.78)
  other vias: 22.86,31.75
S$276  (via drill 1 pad 1.78)
  other vias: 22.86,29.21
S$277  (via drill 1 pad 1.78)
  other vias: 25.4,29.21
S$278  (via drill 1 pad 1.78)
  other vias: 27.94,29.21
S$279  (via drill 1 pad 1.78)
  other vias: 30.48,29.21
S$280  (via drill 1 pad 1.78)
  other vias: 30.48,26.67
S$281  (via drill 1 pad 1.78)
  other vias: 30.48,24.13
S$282  (via drill 1 pad 1.78)
  other vias: 30.48,21.59
S$283  (via drill 1 pad 1.78)
  other vias: 30.48,19.05
S$284  (via drill 1 pad 1.78)
  other vias: 30.48,16.51
S$285  (via drill 1 pad 1.78)
  other vias: 30.48,13.97
S$286  (via drill 1 pad 1.78)
  other vias: 30.48,11.43
S$287  (via drill 1 pad 1.78)
  other vias: 27.94,11.43
S$288  (via drill 1 pad 1.78)
  other vias: 27.94,13.97
S$289  (via drill 1 pad 1.78)
  other vias: 27.94,16.51
S$290  (via drill 1 pad 1.78)
  other vias: 27.94,19.05
S$291  (via drill 1 pad 1.78)
  other vias: 27.94,21.59
S$292  (via drill 1 pad 1.78)
  other vias: 27.94,24.13
S$293  (via drill 1 pad 1.78)
  other vias: 27.94,26.67
S$294  (via drill 1 pad 1.78)
  other vias: 25.4,26.67
S$295  (via drill 1 pad 1.78)
  other vias: 22.86,26.67
S$296  (via drill 1 pad 1.78)
  other vias: 22.86,24.13
S$297  (via drill 1 pad 1.78)
  other vias: 25.4,24.13
S$298  (via drill 1 pad 1.78)
  other vias: 25.4,21.59
S$299  (via drill 1 pad 1.78)
  other vias: 22.86,21.59
S$300  (via drill 1 pad 1.78)
  other vias: 22.86,19.05
S$301  (via drill 1 pad 1.78)
  other vias: 25.4,19.05
S$302  (via drill 1 pad 1.78)
  other vias: 25.4,16.51
S$303  (via drill 1 pad 1.78)
  other vias: 22.86,16.51
S$304  (via drill 1 pad 1.78)
  other vias: 25.4,13.97
S$305  (via drill 1 pad 1.78)
  other vias: 22.86,13.97
S$306  (via drill 1 pad 1.78)
  other vias: 25.4,11.43
S$307  (via drill 1 pad 1.78)
  other vias: 22.86,11.43
S$308  (via drill 1 pad 1.78)
  other vias: 22.86,8.89
S$309  (via drill 1 pad 1.78)
  other vias: 22.86,6.35
S$310  (via drill 1 pad 1.78)
  other vias: 22.86,3.81
S$311  (via drill 1 pad 1.78)
  other vias: 25.4,8.89
S$312  (via drill 1 pad 1.78)
  other vias: 25.4,6.35
S$313  (via drill 1 pad 1.78)
  other vias: 25.4,3.81
S$314  (via drill 1 pad 1.78)
  other vias: 27.94,3.81
S$315  (via drill 1 pad 1.78)
  other vias: 27.94,6.35
S$316  (via drill 1 pad 1.78)
  other vias: 27.94,8.89
S$317  (via drill 1 pad 1.78)
  other vias: 30.48,8.89
S$318  (via drill 1 pad 1.78)
  other vias: 30.48,6.35
S$319  (via drill 1 pad 1.78)
  other vias: 30.48,3.81
S$320  (via drill 1 pad 1.78)
  other vias: 20.32,3.81
S$321  (via drill 1 pad 1.78)
  other vias: 17.78,3.81
S$322  (via drill 1 pad 1.78)
  other vias: 15.24,3.81
S$323  (via drill 1 pad 1.78)
  other vias: 12.7,3.81
S$324  (via drill 1 pad 1.78)
  other vias: 10.16,3.81
S$325  (via drill 1 pad 1.78)
  other vias: 7.62,3.81
S$326  (via drill 1 pad 1.78)
  other vias: 5.08,3.81
S$327  (via drill 1 pad 1.78)
  other vias: 5.08,6.35
S$328  (via drill 1 pad 1.78)
  other vias: 7.62,6.35
S$329  (via drill 1 pad 1.78)
  other vias: 10.16,6.35
S$330  (via drill 1 pad 1.78)
  other vias: 12.7,6.35
S$331  (via drill 1 pad 1.78)
  other vias: 15.24,6.35
S$332  (via drill 1 pad 1.78)
  other vias: 17.78,6.35
S$333  (via drill 1 pad 1.78)
  other vias: 20.32,6.35
S$334  (via drill 1 pad 1.78)
  other vias: 20.32,8.89
S$335  (via drill 1 pad 1.78)
  other vias: 17.78,8.89
S$336  (via drill 1 pad 1.78)
  other vias: 15.24,8.89
S$337  (via drill 1 pad 1.78)
  other vias: 12.7,8.89
S$338  (via drill 1 pad 1.78)
  other vias: 10.16,8.89
S$339  (via drill 1 pad 1.78)
  other vias: 7.62,8.89
S$340  (via drill 1 pad 1.78)
  other vias: 5.08,8.89
S$341  (via drill 1 pad 1.78)
  other vias: 5.08,11.43
S$342  (via drill 1 pad 1.78)
  other vias: 7.62,11.43
S$343  (via drill 1 pad 1.78)
  other vias: 10.16,11.43
S$344  (via drill 1 pad 1.78)
  other vias: 12.7,11.43
S$345  (via drill 1 pad 1.78)
  other vias: 15.24,11.43
S$346  (via drill 1 pad 1.78)
  other vias: 17.78,11.43
S$347  (via drill 1 pad 1.78)
  other vias: 20.32,11.43
S$348  (via drill 1 pad 1.78)
  other vias: 20.32,13.97
S$349  (via drill 1 pad 1.78)
  other vias: 17.78,13.97
S$350  (via drill 1 pad 1.78)
  other vias: 15.24,13.97
S$351  (via drill 1 pad 1.78)
  other vias: 12.7,13.97
S$352  (via drill 1 pad 1.78)
  other vias: 10.16,13.97
S$353  (via drill 1 pad 1.78)
  other vias: 7.62,13.97
S$354  (via drill 1 pad 1.78)
  other vias: 5.08,13.97
S$355  (via drill 1 pad 1.78)
  other vias: 5.08,16.51
S$356  (via drill 1 pad 1.78)
  other vias: 7.62,16.51
S$357  (via drill 1 pad 1.78)
  other vias: 10.16,16.51
S$358  (via drill 1 pad 1.78)
  other vias: 12.7,16.51
S$359  (via drill 1 pad 1.78)
  other vias: 15.24,16.51
S$360  (via drill 1 pad 1.78)
  other vias: 17.78,16.51
S$361  (via drill 1 pad 1.78)
  other vias: 20.32,16.51
S$362  (via drill 1 pad 1.78)
  other vias: 20.32,19.05
S$363  (via drill 1 pad 1.78)
  other vias: 17.78,19.05
S$364  (via drill 1 pad 1.78)
  other vias: 15.24,19.05
S$365  (via drill 1 pad 1.78)
  other vias: 12.7,19.05
S$366  (via drill 1 pad 1.78)
  other vias: 10.16,19.05
S$367  (via drill 1 pad 1.78)
  other vias: 7.62,19.05
S$368  (via drill 1 pad 1.78)
  other vias: 5.08,19.05
S$369  (via drill 1 pad 1.78)
  other vias: 5.08,21.59
S$370  (via drill 1 pad 1.78)
  other vias: 7.62,21.59
S$371  (via drill 1 pad 1.78)
  other vias: 10.16,21.59
S$372  (via drill 1 pad 1.78)
  other vias: 12.7,21.59
S$373  (via drill 1 pad 1.78)
  other vias: 15.24,21.59
S$374  (via drill 1 pad 1.78)
  other vias: 17.78,21.59
S$375  (via drill 1 pad 1.78)
  other vias: 20.32,21.59
S$376  (via drill 1 pad 1.78)
  other vias: 20.32,24.13
S$377  (via drill 1 pad 1.78)
  other vias: 17.78,24.13
S$378  (via drill 1 pad 1.78)
  other vias: 15.24,24.13
S$379  (via drill 1 pad 1.78)
  other vias: 12.7,24.13
S$380  (via drill 1 pad 1.78)
  other vias: 10.16,24.13
S$381  (via drill 1 pad 1.78)
  other vias: 7.62,24.13
S$382  (via drill 1 pad 1.78)
  other vias: 5.08,24.13
S$383  (via drill 1 pad 1.78)
  other vias: 5.08,26.67
S$384  (via drill 1 pad 1.78)
  other vias: 7.62,26.67
S$385  (via drill 1 pad 1.78)
  other vias: 10.16,26.67
S$386  (via drill 1 pad 1.78)
  other vias: 12.7,26.67
S$387  (via drill 1 pad 1.78)
  other vias: 15.24,26.67
S$388  (via drill 1 pad 1.78)
  other vias: 17.78,26.67
S$389  (via drill 1 pad 1.78)
  other vias: 20.32,26.67
S$390  (via drill 1 pad 1.78)
  other vias: 20.32,29.21
S$391  (via drill 1 pad 1.78)
  other vias: 17.78,29.21
S$392  (via drill 1 pad 1.78)
  other vias: 15.24,29.21
S$393  (via drill 1 pad 1.78)
  other vias: 12.7,29.21
S$394  (via drill 1 pad 1.78)
  other vias: 10.16,29.21
S$395  (via drill 1 pad 1.78)
  other vias: 7.62,29.21
S$396  (via drill 1 pad 1.78)
  other vias: 5.08,29.21
S$397  (via drill 1 pad 1.78)
  other vias: 20.32,31.75
S$398  (via drill 1 pad 1.78)
  other vias: 17.78,31.75
S$399  (via drill 1 pad 1.78)
  other vias: 15.24,31.75
S$400  (via drill 1 pad 1.78)
  other vias: 12.7,31.75
S$401  (via drill 1 pad 1.78)
  other vias: 10.16,31.75
S$402  (via drill 1 pad 1.78)
  other vias: 7.62,31.75
S$403  (via drill 1 pad 1.78)
  other vias: 5.08,31.75
S$404  (via drill 1 pad 1.78)
  other vias: 5.08,34.29
S$405  (via drill 1 pad 1.78)
  other vias: 7.62,34.29
S$406  (via drill 1 pad 1.78)
  other vias: 10.16,34.29
S$407  (via drill 1 pad 1.78)
  other vias: 12.7,34.29
S$408  (via drill 1 pad 1.78)
  other vias: 15.24,34.29
S$409  (via drill 1 pad 1.78)
  other vias: 17.78,34.29
S$410  (via drill 1 pad 1.78)
  other vias: 20.32,34.29
S$411  (via drill 1 pad 1.78)
  other vias: 20.32,36.83
S$412  (via drill 1 pad 1.78)
  other vias: 17.78,36.83
S$413  (via drill 1 pad 1.78)
  other vias: 15.24,36.83
S$414  (via drill 1 pad 1.78)
  other vias: 12.7,36.83
S$415  (via drill 1 pad 1.78)
  other vias: 10.16,36.83
S$416  (via drill 1 pad 1.78)
  other vias: 7.62,36.83
S$417  (via drill 1 pad 1.78)
  other vias: 5.08,36.83
S$418  (via drill 1 pad 1.78)
  other vias: 5.08,39.37
S$419  (via drill 1 pad 1.78)
  other vias: 7.62,39.37
S$420  (via drill 1 pad 1.78)
  other vias: 10.16,39.37
S$421  (via drill 1 pad 1.78)
  other vias: 12.7,39.37
S$422  (via drill 1 pad 1.78)
  other vias: 15.24,39.37
S$423  (via drill 1 pad 1.78)
  other vias: 17.78,39.37
S$424  (via drill 1 pad 1.78)
  other vias: 20.32,39.37
S$425  (via drill 1 pad 1.78)
  other vias: 20.32,41.91
S$426  (via drill 1 pad 1.78)
  other vias: 17.78,41.91
S$427  (via drill 1 pad 1.78)
  other vias: 20.32,44.45
S$428  (via drill 1 pad 1.78)
  other vias: 17.78,44.45
S$429  (via drill 1 pad 1.78)
  other vias: 17.78,46.99
S$430  (via drill 1 pad 1.78)
  other vias: 20.32,46.99
S$431  (via drill 1 pad 1.78)
  other vias: 20.32,49.53
S$432  (via drill 1 pad 1.78)
  other vias: 15.24,46.99
S$433  (via drill 1 pad 1.78)
  other vias: 15.24,44.45
S$434  (via drill 1 pad 1.78)
  other vias: 15.24,41.91
S$435  (via drill 1 pad 1.78)
  other vias: 12.7,41.91
S$436  (via drill 1 pad 1.78)
  other vias: 12.7,44.45
S$437  (via drill 1 pad 1.78)
  other vias: 12.7,46.99
S$438  (via drill 1 pad 1.78)
  other vias: 10.16,46.99
S$439  (via drill 1 pad 1.78)
  other vias: 10.16,44.45
S$440  (via drill 1 pad 1.78)
  other vias: 10.16,41.91
S$441  (via drill 1 pad 1.78)
  other vias: 7.62,41.91
S$442  (via drill 1 pad 1.78)
  other vias: 5.08,41.91
S$443  (via drill 1 pad 1.78)
  other vias: 5.08,44.45
S$444  (via drill 1 pad 1.78)
  other vias: 7.62,44.45
S$445  (via drill 1 pad 1.78)
  other vias: 7.62,46.99
S$446  (via drill 1 pad 1.78)
  other vias: 5.08,46.99
S$447  (via drill 1 pad 1.78)
  other vias: 12.7,49.53
S$448  (via drill 1 pad 1.78)
  other vias: 10.16,49.53
S$449  (via drill 1 pad 1.78)
  other vias: 7.62,49.53
S$450  (via drill 1 pad 1.78)
  other vias: 5.08,49.53
S$451  (via drill 1 pad 1.78)
  other vias: 2.54,49.53
S$452  (via drill 1 pad 1.78)
  other vias: 2.54,46.99
S$453  (via drill 1 pad 1.78)
  other vias: 2.54,44.45
S$454  (via drill 1 pad 1.78)
  other vias: 2.54,41.91
S$455  (via drill 1 pad 1.78)
  other vias: 2.54,39.37
S$456  (via drill 1 pad 1.78)
  other vias: 2.54,36.83
S$457  (via drill 1 pad 1.78)
  other vias: 2.54,34.29
S$458  (via drill 1 pad 1.78)
  other vias: 2.54,31.75
S$459  (via drill 1 pad 1.78)
  other vias: 2.54,29.21
S$460  (via drill 1 pad 1.78)
  other vias: 2.54,26.67
S$461  (via drill 1 pad 1.78)
  other vias: 2.54,24.13
S$462  (via drill 1 pad 1.78)
  other vias: 2.54,21.59
S$463  (via drill 1 pad 1.78)
  other vias: 2.54,19.05
S$464  (via drill 1 pad 1.78)
  other vias: 2.54,16.51
S$465  (via drill 1 pad 1.78)
  other vias: 2.54,13.97
S$466  (via drill 1 pad 1.78)
  other vias: 2.54,11.43
S$467  (via drill 1 pad 1.78)
  other vias: 2.54,8.89
S$468  (via drill 1 pad 1.78)
  other vias: 2.54,6.35
S$469  (via drill 1 pad 1.78)
  other vias: 2.54,3.81
SCL
  Top 0.813: 62.23,14.48 63.5,13.21 JP1.1 IC1.12 | 62.23,14.48 60.45,16.26 60.45,20.83 57.91,23.37 J1.5 | R2.1 63.5,16.26 62.48,15.24 62.48,14.73 62.23,14.48
SDA
  Top 0.813: IC1.11 JP1.2 R1.1
  Bottom 0.813: J1.6 60.45,22.35 60.45,14.22 60.96,14.22 R1.1

### Text on the board
tNames: 37720